# Altium schematic sheet UART-to-USB.SchDoc
size A
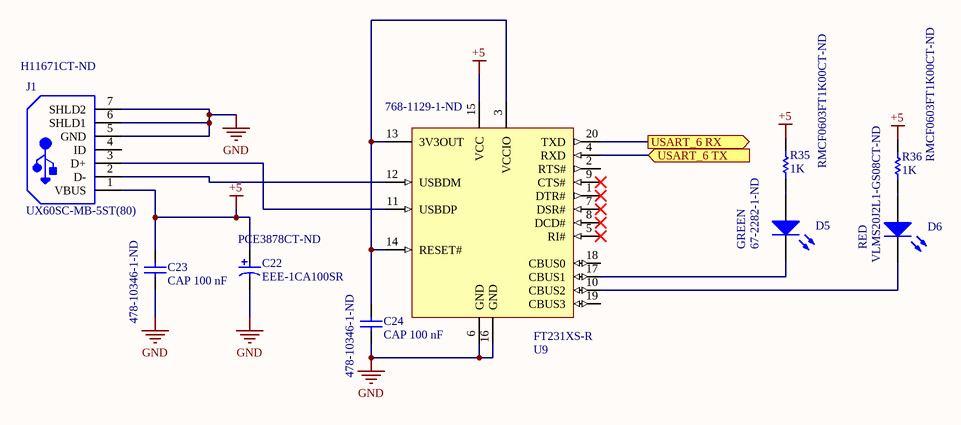
[diagram p0: UART-to-USB.SchDoc]

## Parts
C22  EEE-1CA100SR  Supplier Part Number 1: PCE3878CT-ND  [PNSC-EEE1CA100SR_L]
C23  CAP 100 nF  Supplier Part Number 1: 478-10346-1-ND  [06035C104KAT4A]
C24  CAP 100 nF  Supplier Part Number 1: 478-10346-1-ND  [06035C104KAT4A]
D5  GREEN  Supplier Part Number 1: 67-2282-1-ND  [Vishay VLMx20 Low Current Mini SMD LED]
D6  RED  Supplier Part Number 1: VLMS20J2L1-GS08CT-ND  [Vishay VLMx20 Low Current Mini SMD LED]
J1  UX60SC-MB-5ST(80)  Supplier Part Number 1: H11671CT-ND  [HIRO-UX60SC-MB-5ST(80)_V]
R35  1K  Supplier Part Number 1: RMCF0603FT1K00CT-ND  [CR0603-J/-000ELF]
R36  1K  Supplier Part Number 1: RMCF0603FT1K00CT-ND  [CR0603-J/-000ELF]
U9  FT231XS-R  Supplier Part Number 1: 768-1129-1-ND  [SSOP-20_L]

## Ports
USART_6 RX (out), USART_6 TX (in)

## Nets
+5: C22.1 C23.1 J1.1(VBUS) R35.2 R36.2 U9.15(VCC)
GND: C22.2 C23.2 C24.2 J1.5(GND) J1.6(SHLD1) J1.7(SHLD2) U9.6(GND) U9.16(GND)
USART_6 RX: U9.20(TXD) ; port USART_6 RX
USART_6 TX: U9.4(RXD) ; port USART_6 TX
NetC24_1: C24.1 U9.3(VCCIO) U9.13(3V3OUT) U9.14(RESET#)
NetD5_1: D5.1(A) R35.1
NetD5_2: D5.2(K) U9.17(CBUS1)
NetD6_1: D6.1(A) R36.1
NetD6_2: D6.2(K) U9.10(CBUS2)
NetJ1_2: J1.2(D-) U9.12(USBDM)
NetJ1_3: J1.3(D+) U9.11(USBDP)

Not connected (* = marked no-connect by the designer): J1 4(ID); U9 1(DTR#)* 2(RTS#) 5(RI#)* 7(DSR#)* 8(DCD#)* 9(CTS#)* 18(CBUS0) 19(CBUS3)

## Library data of the parts
C22 = CMP-2000-06199-1: Aluminum Electrolytic Capacitor, 10 uF, +/- 20%, -40 to 85 degC, 2-Pin SMD, RoHS, Tape and Reel; Manufacturer: Panasonic; Lead Length: 1.8mm; No. of Pins: 2; Ripple Current Frequency: 120Hz; Ripple Current Temperature: 85°C; External Depth: 4.3mm; Operating Lifetime: 2000h; Power Factor: 0.16; Lead Cross-section Width: 0.65mm; Product Range: PANASONIC-SSeries; Voltage Rating V DC: 16V; Leakage Current: 3µA; Ripple Current AC: 28mA; AE Capacitor Case: RadialCan-SMD; Capacitance: 10µF; Lifetime @ Temperature: 2000hours@85°C; External Length / Height: 5.4mm; SVHC: NoSVHC(16-Dec-2013); Packaging: CutTape; Series: VS; Package Description: 2-Pin Surface Mount Device, Body 4.5 x 4.5 mm; Tolerance -: 20%; Capacitor Terminals: SMD; Lead Spacing: 1mm; Package / Case: B; Capacitance Tolerance: ±20%; Operating life Time: 2000h; Tape Width: 12mm; Power Factor Frequency: 120Hz; Voltage Rating: 16V; Diameter: 4mm; Operating Temperature Max: 85°C; Datasheet URL: https://datasheet.ciiva.com/19458/1355487-19458346.pdf; Capacitor Mounting: SMD; External Width: 4.3mm; Operating Life Temperature: 85°C; Capacitance Tolerance ±: ±20%; Package Reference: EEE1CA100SR; AC Ripple Current: 28mA; Tolerance +: 20%; Height: 5.4mm; Datasheet Version: 04/2005; Operating Temperature Min: -40°C; Capacitor Case Style: RadialCan-SMD; Mounting Technology: SurfaceMount; Operating Temperature Range: -40°Cto+85°C; Manufacturer URL: http://www.panasonic.com/; Life Time @ Temperature: 2000hours@85°C; Supplier 1: Digi-Key
C23 C24 = Cap: Capacitor; Published: 8-Jun-2000; LatestRevisionDate: 17-Jul-2002; LatestRevisionNote: Re-released for DXP Platform.; Publisher: Altium Limited; Supplier 1: Digi-Key
D5 D6 = LED2: Typical RED, GREEN, YELLOW, AMBER GaAs LED; Published: 8-Jun-2000; LatestRevisionDate: 17-Jul-2002; LatestRevisionNote: Re-released for DXP Platform.; PackageVersion: Feb-2002; PackageReference: 3.2X1.6X1.1; Publisher: Altium Limited; PackageDescription: SM LED; 2 Flat Leads; Supplier 1: Digi-Key
J1 = CMP-2000-07376-1: Mini-B Connector, SMT Mount Receptacle Meeting Requirement of USB 2.0 Standard, 5 V, 1 A, -30 to 75 degC, 5-Pin SMD, RoHS, Tape and Reel; Manufacturer: Hirose Electric; Product Length (mm): 7.7mm; Voltage Rating Max: 5VAC; Number of Contacts: 5POS; Number of Ports: 1Port; Product Height (mm): 3.95mm; Product Depth (mm): 7mm; Pitch (mm): 0.8mm; Gender: RCP; Current Rating (Max): 1A; DELETED: Compliant; Product Diameter (mm): NotRequiredmm; Body Orientation: RightAngle; Operating Temp Range: -30Cto75C; Packaging: TapeandReel; Termination Method: Solder; Number of Terminals: 5; Package Description: 5-Pin Surface Mount Device, Body 7.7 x 7 mm, Pitch 0.8 mm; Mounting Technology: SurfaceMount; Contact Material: CopperAlloy; Package Reference: UX60SC-MB-5ST(80); Operating Temperature Min Deg. C: -30C; Housing Material: Synthetic; Operating Temperature Max Deg. C: 75C; Manufacturer URL: https://www.hirose.com; Datasheet Version: 04/2008; Type: Mini-USB; Datasheet URL: https://datasheet.ciiva.com/4598/e24000153-34949-4598883.pdf; Contact Plating: Gold; Mounting Style: ThroughHole; Supplier 1: Digi-Key
R35 R36 = Res1: Resistor; Published: 8-Jun-2000; LatestRevisionDate: 17-Jul-2002; LatestRevisionNote: Re-released for DXP Platform.; PackageReference: AXIAL-0.3; Publisher: Altium Limited; PackageDescription: Axial Device, Thru-Hole; 2 Leads; 0.3 in Pin Spacing; Value: 1K; Supplier 1: Digi-Key
U9 = CMP-0248-00024-2: USB to Full-Handshake UART Interface Chip, UHCI/OHCI/EHCI Compatible, USB 2.0 Compatible, -40 to +85 degC, 20-Pin SSOP, Pb-Free, Tape and Reel; Manufacturer: FTDI; PackageVersion: Feb-13; PackageReference: SSOP-20; ComponentLink1Description: Manufacturer URL; ComponentLink2Description: Datasheet; PackageDescription: 20-Pin Small Outline Package, 8.6 x 3.9 mm Body, 0.635 mm Pitch; ComponentLink3URL: www.ftdichip.com/Products/ICs/FT231X.html; PartNumber: FT231XS-R; DatasheetVersion: ver 1.2, Feb-2013; ComponentLink2URL: http://www.ftdichip.com/Support/Documents/DataSheets/ICs/DS_FT231X.pdf; Code_JEDEC: MO-137-AD; ComponentLink3Description: FT231X Product Page; RevisionNote: DatasheetVersion updated to 1.2 Feb-2013; ComponentLink1URL: http://www.ftdichip.com/; Supplier 1: Digi-Key